# Altium schematic sheet Sheet1.SchDoc
size A4; SheetNumber: 1; SheetTotal: 1
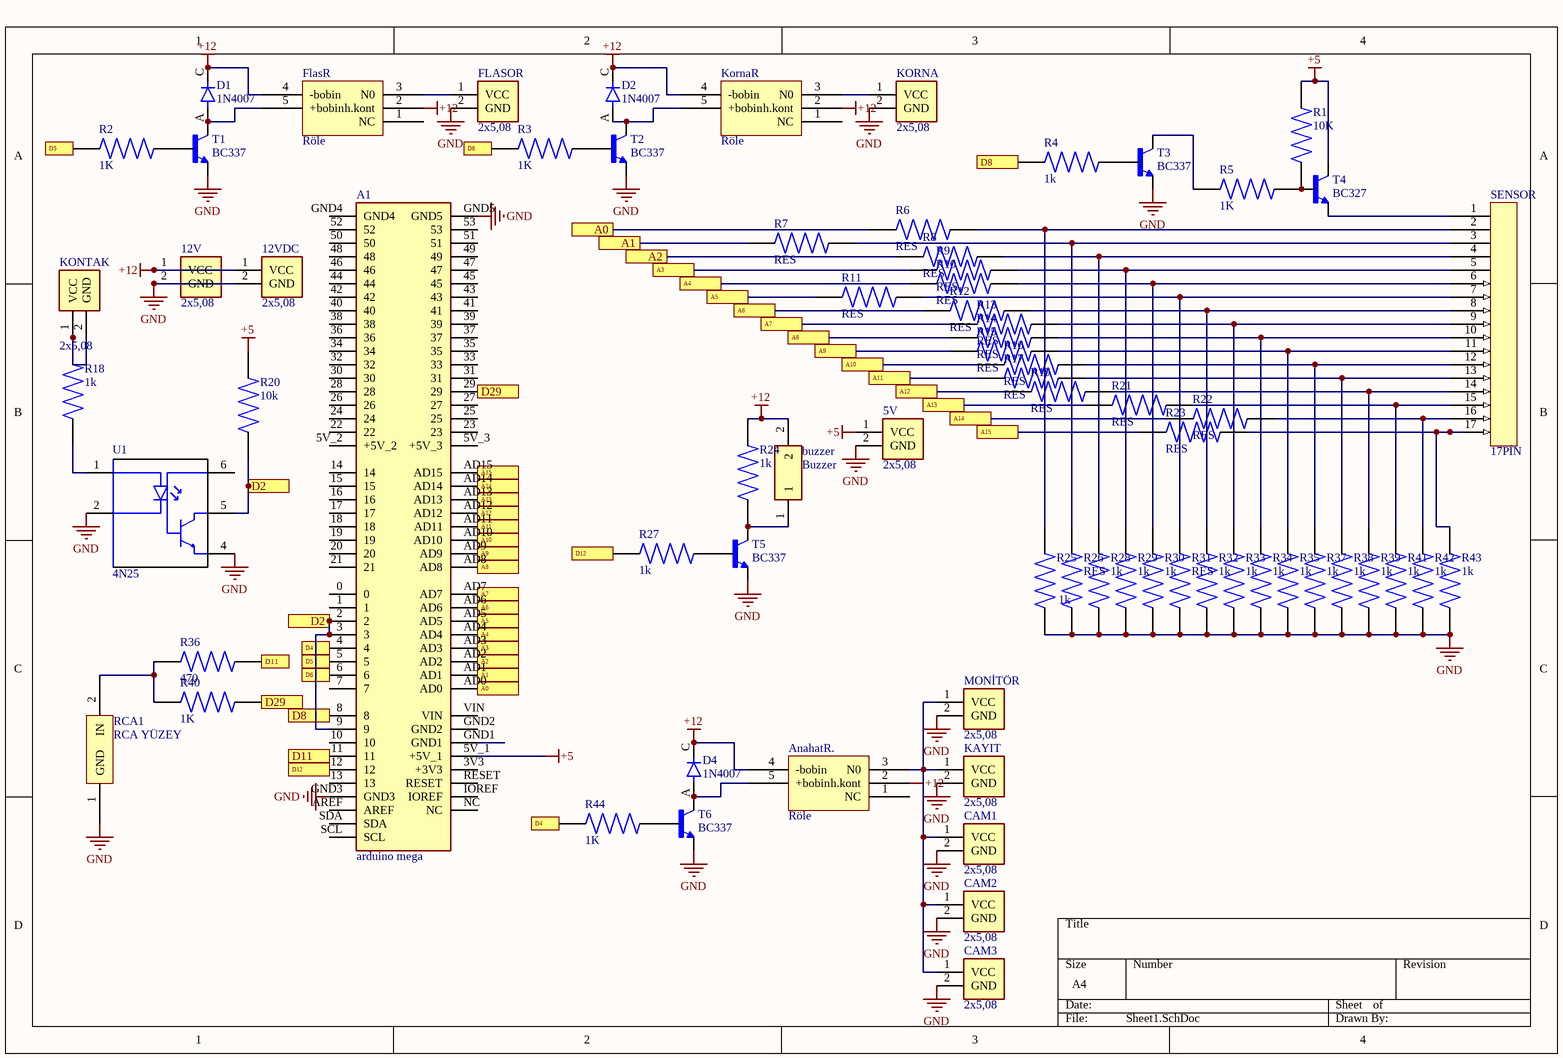
[diagram p0: Sheet1.SchDoc]

## Parts
5V  2x5,08  [2x5,08]
12V  2x5,08  [2x5,08]
12VDC  2x5,08  [2x5,08]
A1  arduino mega  [ARDUINO_A000067]
AnahatR.  Röle  [Röle]
buzzer  Buzzer  [Buzzer]
CAM1  2x5,08  [2x5,08]
CAM2  2x5,08  [2x5,08]
CAM3  2x5,08  [2x5,08]
D1  1N4007  [1N4007]
D2  1N4007  [1N4007]
D4  1N4007  [1N4007]
FLASOR  2x5,08  [2x5,08]
FlasR  Röle  [Röle]
KAYIT  2x5,08  [2x5,08]
KONTAK  2x5,08  [2x5,08]
KORNA  2x5,08  [2x5,08]
KornaR  Röle  [Röle]
MONİTÖR  2x5,08  [2x5,08]
R1  10K  [res]
R2  1K  [res]
R3  1K  [res]
R4  1k  [res]
R5  1K  [res]
R6  RES  [res]
R7  RES  [res]
R8  RES  [res]
R9  RES  [res]
R10  RES  [res]
R11  RES  [res]
R12  RES  [res]
R13  RES  [res]
R14  RES  [res]
R15  RES  [res]
R16  RES  [res]
R17  RES  [res]
R18  1k  [res]
R19  RES  [res]
R20  10k  [res]
R21  RES  [res]
R22  RES  [res]
R23  RES  [res]
R24  1k  [res]
R25  1k  [res]
R26  RES  [res]
R27  1k  [res]
R28  1k  [res]
R29  1k  [res]
R30  1k  [res]
R31  RES  [res]
R32  1k  [res]
R33  1k  [res]
R34  1k  [res]
R35  1k  [res]
R36  470  [res]
R37  1k  [res]
R38  1k  [res]
R39  1k  [res]
R40  1K  [res]
R41  1k  [res]
R42  1k  [res]
R43  1k  [res]
R44  1K  [res]
RCA1  RCA YÜZEY  [RCA]
SENSOR  17PİN  [17x5,08]
T1  BC337  [BC337-TO92]
T2  BC337  [BC337-TO92]
T3  BC337  [BC337-TO92]
T4  BC327  [BC337-TO92]
T5  BC337  [BC337-TO92]
T6  BC337  [BC337-TO92]
U1  4N25  [4N25]

## Ports
A0, A1, A2, A3, A4, A5, A6, A7, A8, A9, A10, A11, A12, A13, A14, A15, D2, D4, D5, D6, D8, D11, D12, D29

## Nets
+5: 5V.1(VCC) A1.5V_1(+5V_1) R1.2 R20.2 T4.3(C)
+12: 12V.1(VCC) 12VDC.1(VCC) AnahatR..2(h.kont) AnahatR..4(-bobin) buzzer.2 D1.C D2.C D4.C FlasR.2(h.kont) FlasR.4(-bobin) KornaR.2(h.kont) KornaR.4(-bobin) R24.2
GND: 5V.2(GND) 12V.2(GND) 12VDC.2(GND) A1.GND3 A1.GND5 CAM1.2(GND) CAM2.2(GND) CAM3.2(GND) FLASOR.2(GND) KAYIT.2(GND) KORNA.2(GND) MONİTÖR.2(GND) R25.1 R26.1 R28.1 R29.1 R30.1 R31.1 R32.1 R33.1 R34.1 R35.1 R37.1 R38.1 R39.1 R41.1 R42.1 R43.1 RCA1.1(GND) T1.1(E) T2.1(E) T3.1(E) T5.1(E) T6.1(E) U1.2(K) U1.4(E)
A0: A1.AD0 R6.1 ; port A0
A1: A1.AD1 R7.1 ; port A1
A2: A1.AD2 R8.1 ; port A2
A3: A1.AD3 R9.1 ; port A3
A4: A1.AD4 R10.1 ; port A4
A5: A1.AD5 R11.1 ; port A5
A6: A1.AD6 R12.1 ; port A6
A7: A1.AD7 R13.1 ; port A7
A8: A1.AD8 R14.1 ; port A8
A9: A1.AD9 R15.1 ; port A9
A10: A1.AD10 R16.1 ; port A10
A11: A1.AD11 R17.1 ; port A11
A12: A1.AD12 R19.1 ; port A12
A13: A1.AD13 R21.1 ; port A13
A14: A1.AD14 R22.1 ; port A14
A15: A1.AD15 R23.1 ; port A15
D2: A1.2 A1.3 A1.9 R20.1 U1.5(C) ; port D2
D4: A1.4 R44.1 ; port D4
D5: A1.5 R2.1 ; port D5
D6: A1.6 R3.1 ; port D6
D8: A1.8 R4.1 ; port D8
D11: A1.11 R36.2 ; port D11
D12: A1.12 R27.1 ; port D12
D29: A1.29 R40.2 ; port D29
NetAnahatR._3: AnahatR..3(N0) CAM1.1(VCC) CAM2.1(VCC) CAM3.1(VCC) KAYIT.1(VCC) MONİTÖR.1(VCC)
NetAnahatR._5: AnahatR..5(+bobin) D4.A T6.3(C)
Netbuzzer_1: buzzer.1 R24.1 T5.3(C)
NetD1_A: D1.A FlasR.5(+bobin) T1.3(C)
NetD2_A: D2.A KornaR.5(+bobin) T2.3(C)
NetFLASOR_1: FLASOR.1(VCC) FlasR.3(N0)
NetKONTAK_1: KONTAK.1(VCC) KONTAK.2(GND) R18.1
NetKORNA_1: KORNA.1(VCC) KornaR.3(N0)
NetR1_1: R1.1 R5.1 T4.2(B)
NetR2_2: R2.2 T1.2(B)
NetR3_2: R3.2 T2.2(B)
NetR4_2: R4.2 T3.2(B)
NetR5_2: R5.2 T3.3(C)
NetR6_2: R6.2 R25.2 SENSOR.2
NetR7_2: R7.2 R26.2 SENSOR.3
NetR8_2: R8.2 R28.2 SENSOR.4
NetR9_2: R9.2 R29.2 SENSOR.5
NetR10_2: R10.2 R30.2 SENSOR.6
NetR11_2: R11.2 R31.2 SENSOR.7
NetR12_2: R12.2 R32.2 SENSOR.8
NetR13_2: R13.2 R33.2 SENSOR.9
NetR14_2: R14.2 R34.2 SENSOR.10
NetR15_2: R15.2 R35.2 SENSOR.11
NetR16_2: R16.2 R37.2 SENSOR.12
NetR17_2: R17.2 R38.2 SENSOR.13
NetR18_2: R18.2 U1.1(A)
NetR19_2: R19.2 R39.2 SENSOR.14
NetR21_2: R21.2 R41.2 SENSOR.15
NetR22_2: R22.2 R42.2 SENSOR.16
NetR23_2: R23.2 R43.2 SENSOR.17
NetR27_2: R27.2 T5.2(B)
NetR36_1: R36.1 R40.1 RCA1.2(IN)
NetR44_2: R44.2 T6.2(B)
NetSENSOR_1: SENSOR.1 T4.1(E)

Not connected (* = marked no-connect by the designer): A1 0 1 3V3(+3V3) 5V_2(+5V_2) 5V_3(+5V_3) 7 10 13 14 15 16 17 18 19 20 21 22 23 24 25 26 27 28 30 31 32 33 34 35 36 37 38 39 40 41 42 43 44 45 46 47 48 49 50 51 52 53 AREF GND1 GND2 GND4 IOREF NC RESET SCL SDA VIN; AnahatR. 1(NC); FlasR 1(NC); KornaR 1(NC); U1 6(B)

## Library data of the parts
5V 12V 12VDC CAM1-CAM3 FLASOR KAYIT KONTAK KORNA MONİTÖR = 2x5,08: TERMINAL BLOCK,HEADER, 5.08 MM, 2WAY; Product Range:-; Gender:Header; MF: TE Connectivity; MP: 282814-2; EU_RoHS_Compliance: Compliant; SnapEDA_Link: https://www.snapeda.com/parts/282814-2/TE%20Connectivity%20AMP%20Connectors/view-part/2381383/?ref=snap; Availability: Unavailable; Price: None; Package: None; TE_purchase_URL: https://www.te.com/usa-en/product-282814-2.html?te_bu=Cor&te_type=disp&te_campaign=seda_glo_cor-seda-global-disp-prtnr-fy19-seda-model-bom-cta_sma-317_1&elqCampaignId=32493; Value: *
A1 = arduino mega: ATmega2560 Arduino Mega2560 AVRÂ® ATmega AVR MCU 8-Bit Embedded Evaluation Board; MP: A000067; Availability: Unavailable; Package: None; SnapEDA_Link: https://www.snapeda.com/parts/A000067/Arduino/view-part/557398/?ref=snap; Price: None; Value: *; MF: Arduino
buzzer = Buzzer: TERMINAL BLOCK,HEADER, 5.08 MM, 2WAY; Product Range:-; Gender:Header; MF: TE Connectivity; MP: 282814-2; EU_RoHS_Compliance: Compliant; SnapEDA_Link: https://www.snapeda.com/parts/282814-2/TE%20Connectivity%20AMP%20Connectors/view-part/2381383/?ref=snap; Availability: Unavailable; Price: None; Package: None; TE_purchase_URL: https://www.te.com/usa-en/product-282814-2.html?te_bu=Cor&te_type=disp&te_campaign=seda_glo_cor-seda-global-disp-prtnr-fy19-seda-model-bom-cta_sma-317_1&elqCampaignId=32493; Value: *
D1 D2 D4 = 1N4007: Diode Standard 1000V 1A Through Hole DO-204AL _DO-41_; MF: ON Semiconductor; Package: DO-41 Good-Ark; Value: *; Price: None; MP: 1N4007; Availability: Unavailable; SnapEDA_Link: https://www.snapeda.com/parts/1N4007/ON%20Semiconductor/view-part/2816213/?ref=snap
R1-R44 = RES: 1.4 kOhms Â±1% 0.25W, 1/4W Through Hole Resistor Axial Metal Film; MF: Yageo; MP: MFR-25FBF52-1K; SnapEDA_Link: https://www.snapeda.com/parts/MFR-25FBF52-1K/Yageo/view-part/1970177/?ref=snap; Price: None; Availability: Unavailable; Package: Axial Yageo; Value: *
T1-T6 = BC337: Bipolar _BJT_ Transistor NPN 45V 800mA 100MHz 625mW Through Hole TO-92-3; MF: ON Semiconductor; Value: *; Digi-Key_Part_Number: BC33740TACT-ND; Package: TO-92 ON Semiconductor; Digi-Key_Purchase_URL: https://www.digikey.com/product-detail/en/on-semiconductor/BC33740TA/BC33740TACT-ND/1532788?utm_source=snapeda&utm_medium=aggregator&utm_campaign=symbol; SnapEDA_Link: https://www.snapeda.com/parts/BC337/ON%20Semiconductor/view-part/2772334/?ref=snap; MP: BC337
U1 = 4N25: Optoisolator Transistor with Base Output 5000Vrms 1 Channel 6-DIP; MF: Vishay Semiconductor; Package: DIP-6 Lite-On; Value: *; Price: None; MP: 4N25; SnapEDA_Link: https://www.snapeda.com/parts/4N25/Vishay%20Semiconductor%20Opto%20Division/view-part/641454/?ref=snap; Availability: Unavailable